# Altium schematic sheet SixAxBase_Core.SchDoc
size A4
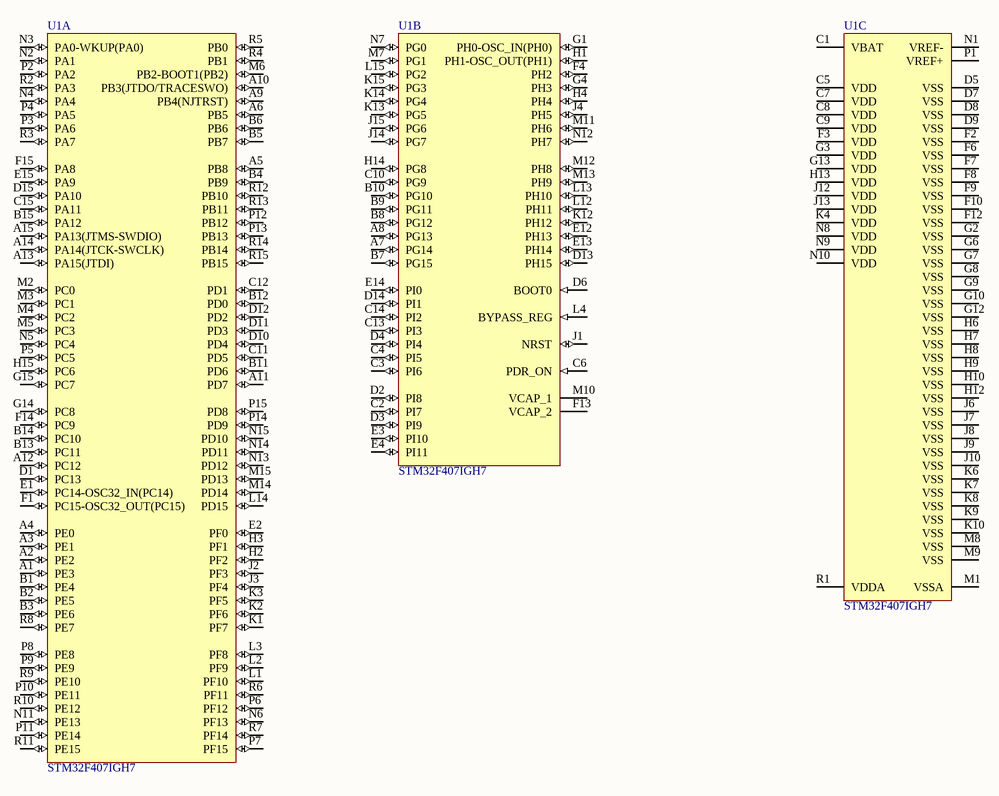
[diagram p0: SixAxBase_Core.SchDoc]

## Parts
U1  STM32F407IGH7  [STM-UFBGA176+25]  (parts A,B,C of 3)

## Nets

Not connected (* = marked no-connect by the designer): U1 A1(PE3) A2(PE2) A3(PE1) A4(PE0) A5(PB8) A6(PB5) A7(PG14) A8(PG13) A9(PB4(NJTRST)) A10(PB3(JTDO/TRACESWO)) A11(PD7) A12(PC12) A13(PA15(JTDI)) A14(PA14(JTCK-SWCLK)) A15(PA13(JTMS-SWDIO)) B1(PE4) B2(PE5) B3(PE6) B4(PB9) B5(PB7) B6(PB6) B7(PG15) B8(PG12) B9(PG11) B10(PG10) B11(PD6) B12(PD0) B13(PC11) B14(PC10) B15(PA12) C1(VBAT) C2(PI7) C3(PI6) C4(PI5) C5(VDD) C6(PDR_ON) C7(VDD) C8(VDD) C9(VDD) C10(PG9) C11(PD5) C12(PD1) C13(PI3) C14(PI2) C15(PA11) D1(PC13) D2(PI8) D3(PI9) D4(PI4) D5(VSS) D6(BOOT0) D7(VSS) D8(VSS) D9(VSS) D10(PD4) D11(PD3) D12(PD2) D13(PH15) D14(PI1) D15(PA10) E1(PC14-OSC32_IN(PC14)) E2(PF0) E3(PI10) E4(PI11) E12(PH13) E13(PH14) E14(PI0) E15(PA9) F1(PC15-OSC32_OUT(PC15)) F2(VSS) F3(VDD) F4(PH2) F6(VSS) F7(VSS) F8(VSS) F9(VSS) F10(VSS) F12(VSS) F13(VCAP_2) F14(PC9) F15(PA8) G1(PH0-OSC_IN(PH0)) G2(VSS) G3(VDD) G4(PH3) G6(VSS) G7(VSS) G8(VSS) G9(VSS) G10(VSS) G12(VSS) G13(VDD) G14(PC8) G15(PC7) H1(PH1-OSC_OUT(PH1)) H2(PF2) H3(PF1) H4(PH4) H6(VSS) H7(VSS) H8(VSS) H9(VSS) H10(VSS) H12(VSS) H13(VDD) H14(PG8) H15(PC6) J1(NRST) J2(PF3) J3(PF4) J4(PH5) J6(VSS) J7(VSS) J8(VSS) J9(VSS) J10(VSS) J12(VDD) J13(VDD) J14(PG7) J15(PG6) K1(PF7) K2(PF6) K3(PF5) K4(VDD) K6(VSS) K7(VSS) K8(VSS) K9(VSS) K10(VSS) K12(PH12) K13(PG5) K14(PG4) K15(PG3) L1(PF10) L2(PF9) L3(PF8) L4(BYPASS_REG) L12(PH11) L13(PH10) L14(PD15) L15(PG2) M1(VSSA) M2(PC0) M3(PC1) M4(PC2) M5(PC3) M6(PB2-BOOT1(PB2)) M7(PG1) M8(VSS) M9(VSS) M10(VCAP_1) M11(PH6) M12(PH8) M13(PH9) M14(PD14) M15(PD13) N1(VREF-) N2(PA1) N3(PA0-WKUP(PA0)) N4(PA4) N5(PC4) N6(PF13) N7(PG0) N8(VDD) N9(VDD) N10(VDD) N11(PE13) N12(PH7) N13(PD12) N14(PD11) N15(PD10) P1(VREF+) P2(PA2) P3(PA6) P4(PA5) P5(PC5) P6(PF12) P7(PF15) P8(PE8) P9(PE9) P10(PE11) P11(PE14) P12(PB12) P13(PB13) P14(PD9) P15(PD8) R1(VDDA) R2(PA3) R3(PA7) R4(PB1) R5(PB0) R6(PF11) R7(PF14) R8(PE7) R9(PE10) R10(PE12) R11(PE15) R12(PB10) R13(PB11) R14(PB14) R15(PB15)

## Library data of the parts
U1 = STM32F407IGH7: ARM Cortex-M4 32-bit MCU+FPU, 210 DMIPS, 1024 kB Flash, 192 kB Internal RAM, 140 I/Os, 176-pin UFBGA, -40 to 105 degC, Tray; Manufacturer: STMicroelectronics; D/A Converter: 2x12-bit; FLASH Size (Prog) (kB): 1024; I/Os (High Current): 140; Internal RAM Size (kB): 192; Operating Frequency(F) (Processor speed) (MHz): 168; Supply Voltage(Vcc) max (V): 3.6; Supply Voltage(Vcc) min (V): 1.8; DatasheetVersion: Rev. 4; PackageVersion: Rev. 4, 06/2013; PackageReference: UFBGA176+25; PackageDescription: 176+25-Ball Ultra Thin Fine Pitch Ball Grid Array, 10 x 10 x 0.6 mm Body, 0.65 mm Pitch; Supplier 1: Digi-Key; Supplier Part Number 1: STM32F407IGH7-ND; Supplier 2: Farnell; Supplier Part Number 2: 2333294; Supplier 3: Newark; Supplier Part Number 3: 99W9911; Supplier 4: Newark; Supplier Part Number 4: 66W7306; Supplier 5: Mouser; Supplier Part Number 5: 511-STM32F407IGH7; Core: ARM Cortex-M4; Packing: Tray; Mounting Technology: Surface Mount; PartNumber: STM32F407IGH7; ComponentLink1Description: Manufacturer URL; ComponentLink1URL: http://www.st.com/web/en/home.html; ComponentLink2Description: Datasheet; ComponentLink2URL: http://www.st.com/st-web-ui/static/active/en/resource/technical/document/datasheet/DM00037051.pdf; ComponentLink3Description: Package Specification; ComponentLink3URL: http://www.st.com/st-web-ui/static/active/en/resource/technical/document/datasheet/DM00037051.pdf